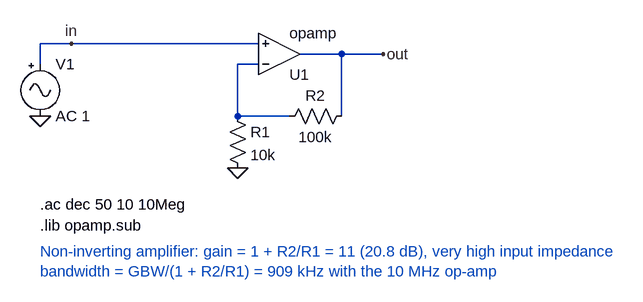
[diagram p0: schematic noninverting_amplifier.asc]
noninverting_amplifier.asc, the LTspice schematic file:
Version 4
SHEET 1 880 680
WIRE 32 160 32 192
WIRE 368 160 32 160
WIRE 336 192 368 192
WIRE 336 272 336 192
WIRE 416 272 336 272
WIRE 560 176 432 176
WIRE 496 272 496 176
FLAG 32 272 0
FLAG 336 352 0
FLAG 80 160 in
FLAG 560 176 out
SYMBOL Misc\signal 32 176 R0
SYMATTR InstName V1
SYMATTR Value AC 1
SYMBOL OpAmps\opamp 400 240 M180
SYMATTR InstName U1
SYMBOL res 512 256 R90
WINDOW 0 0 56 VBottom 2
WINDOW 3 32 56 VTop 2
SYMATTR InstName R2
SYMATTR Value 100k
SYMBOL res 320 256 R0
SYMATTR InstName R1
SYMATTR Value 10k
TEXT 32 408 Left 2 !.ac dec 50 10 10Meg
TEXT 32 440 Left 2 !.lib opamp.sub
TEXT 32 480 Left 2 ;Non-inverting amplifier: gain = 1 + R2/R1 = 11 (20.8 dB), very high input impedance\nbandwidth = GBW/(1 + R2/R1) = 909 kHz with the 10 MHz op-amp

The netlist it stands for:
* noninverting_amplifier.asc
V1 in 0 AC 1
XU1 N001 in out opamp Aol=100K GBW=10Meg  ; pins invin noninvin out
R2 out N001 100k
R1 N001 0 10k
.ac dec 50 10 10Meg
.lib opamp.sub
* Non-inverting amplifier: gain = 1 + R2/R1 = 11 (20.8 dB), very high input impedance
* bandwidth = GBW/(1 + R2/R1) = 909 kHz with the 10 MHz op-amp
.backanno
.end